# Altium schematic sheet output leds.SchDoc
size A4
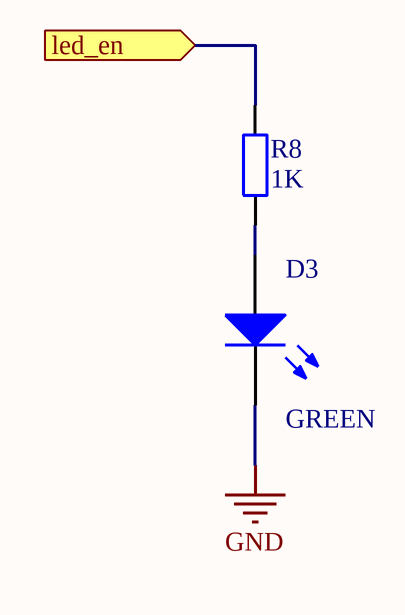
[diagram p0: output leds.SchDoc]

## Parts
D3  value GREEN  [LGQ971]
R8  value 1K  [R0603]  (hidden comment: Res)

## Ports
led_en (in)

## Nets
GND: D3.2(K)
led_en: R8.2 ; port led_en
NetD3_1: D3.1(A) R8.1

## Library data of the parts
D3 = LED2: Typical RED, GREEN, YELLOW, AMBER GaAs LED; farnell: 1226372
R8 = Res2: Resistor; farnell: 9330380